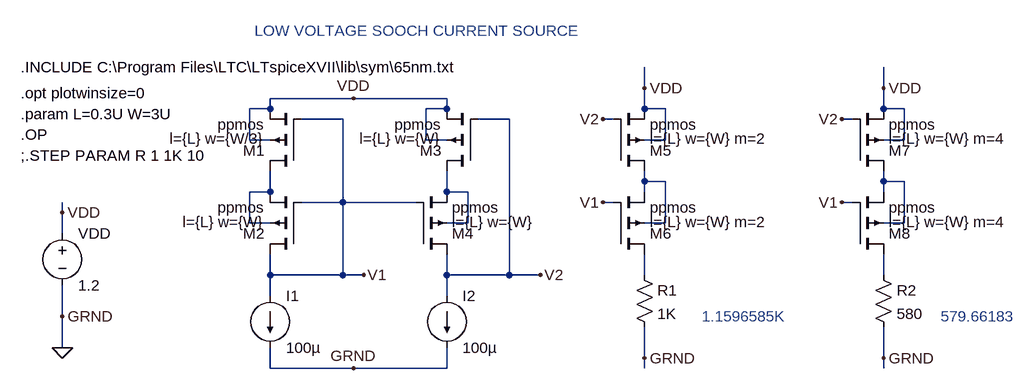
[diagram p0: schematic 16LOW VOLTAGE SOOCH CURRENT SOURCE.asc]
16LOW VOLTAGE SOOCH CURRENT SOURCE.asc, the LTspice schematic file:
Version 4
SHEET 1 1000 680
WIRE 432 -16 432 -48
WIRE 800 -16 800 -48
WIRE -16 0 -144 0
WIRE 128 0 -16 0
WIRE -144 16 -144 0
WIRE -144 16 -176 16
WIRE 128 16 128 0
WIRE 128 16 96 16
WIRE 432 16 432 -16
WIRE 464 16 432 16
WIRE 800 16 800 -16
WIRE 832 16 800 16
WIRE -32 32 -96 32
WIRE 224 32 176 32
WIRE 384 32 368 32
WIRE 752 32 736 32
WIRE -176 64 -176 16
WIRE -144 64 -176 64
WIRE 96 64 96 16
WIRE 128 64 96 64
WIRE 464 64 464 16
WIRE 464 64 432 64
WIRE 832 64 832 16
WIRE 832 64 800 64
WIRE 432 128 432 112
WIRE 464 128 432 128
WIRE 800 128 800 112
WIRE 832 128 800 128
WIRE -144 144 -144 112
WIRE -144 144 -176 144
WIRE 128 144 128 112
WIRE 160 144 128 144
WIRE 432 144 432 128
WIRE 800 144 800 128
WIRE -32 160 -32 32
WIRE -32 160 -96 160
WIRE 80 160 -32 160
WIRE 384 160 368 160
WIRE 752 160 736 160
WIRE -464 176 -464 160
WIRE -176 192 -176 144
WIRE -144 192 -176 192
WIRE 160 192 160 144
WIRE 160 192 128 192
WIRE 464 192 464 128
WIRE 464 192 432 192
WIRE 832 192 832 128
WIRE 832 192 800 192
WIRE -464 208 -464 176
WIRE -144 272 -144 240
WIRE -32 272 -32 160
WIRE -32 272 -144 272
WIRE 0 272 -32 272
WIRE 128 272 128 240
WIRE 224 272 224 32
WIRE 224 272 128 272
WIRE 272 272 224 272
WIRE 432 272 432 240
WIRE 800 272 800 240
WIRE -144 304 -144 272
WIRE 128 304 128 272
WIRE -464 336 -464 288
WIRE -464 384 -464 336
WIRE 432 400 432 352
WIRE 800 400 800 352
WIRE -144 416 -144 384
WIRE -16 416 -144 416
WIRE 128 416 128 384
WIRE 128 416 -16 416
WIRE 432 416 432 400
WIRE 800 416 800 400
FLAG -464 384 0
FLAG -464 336 GRND
FLAG -464 176 VDD
FLAG 0 272 V1
FLAG 368 160 V1
FLAG 272 272 V2
FLAG 368 32 V2
FLAG -16 416 GRND
FLAG 432 400 GRND
FLAG 432 -16 VDD
FLAG -16 0 VDD
FLAG 736 160 V1
FLAG 736 32 V2
FLAG 800 400 GRND
FLAG 800 -16 VDD
SYMBOL pmos4 -96 112 R180
WINDOW 123 56 50 Left 2
SYMATTR Value2 l={L} w={W/3}
SYMATTR InstName M1
SYMATTR Value ppmos
SYMBOL pmos4 -96 240 R180
WINDOW 123 56 50 Left 2
SYMATTR Value2 l={L} w={W}
SYMATTR InstName M2
SYMATTR Value ppmos
SYMBOL current -144 304 R0
WINDOW 123 0 0 Left 0
WINDOW 39 0 0 Left 0
SYMATTR InstName I1
SYMATTR Value 100µ
SYMBOL pmos4 80 240 M180
WINDOW 123 56 50 Left 2
SYMATTR Value2 l={L} w={W}
SYMATTR InstName M4
SYMATTR Value ppmos
SYMBOL pmos4 176 112 R180
WINDOW 123 56 50 Left 2
SYMATTR Value2 l={L} w={W}
SYMATTR InstName M3
SYMATTR Value ppmos
SYMBOL current 128 304 R0
WINDOW 123 0 0 Left 0
WINDOW 39 0 0 Left 0
SYMATTR InstName I2
SYMATTR Value 100µ
SYMBOL pmos4 384 112 M180
WINDOW 123 56 50 Left 2
SYMATTR Value2 l={L} w={W} m=2
SYMATTR InstName M5
SYMATTR Value ppmos
SYMBOL pmos4 384 240 M180
WINDOW 123 56 50 Left 2
SYMATTR Value2 l={L} w={W} m=2
SYMATTR InstName M6
SYMATTR Value ppmos
SYMBOL voltage -464 192 R0
WINDOW 123 0 0 Left 0
WINDOW 39 0 0 Left 0
SYMATTR InstName VDD
SYMATTR Value 1.2
SYMBOL res 416 256 R0
SYMATTR InstName R1
SYMATTR Value 1K
SYMBOL pmos4 752 112 M180
WINDOW 123 56 50 Left 2
SYMATTR Value2 l={L} w={W} m=4
SYMATTR InstName M7
SYMATTR Value ppmos
SYMBOL pmos4 752 240 M180
WINDOW 123 56 50 Left 2
SYMATTR Value2 l={L} w={W} m=4
SYMATTR InstName M8
SYMATTR Value ppmos
SYMBOL res 784 256 R0
SYMATTR InstName R2
SYMATTR Value 580
TEXT -528 -48 Left 2 !.INCLUDE C:\\Program Files\\LTC\\LTspiceXVII\\lib\\sym\\65nm.txt
TEXT -528 -8 Left 2 !.opt plotwinsize=0
TEXT -528 56 Left 2 !.OP
TEXT -528 24 Left 2 !.param L=0.3U W=3U
TEXT -168 -104 Left 2 ;LOW VOLTAGE SOOCH CURRENT SOURCE
TEXT -528 88 Left 2 !;.STEP PARAM R 1 1K 10
TEXT 520 336 Left 2 ;1.1596585K
TEXT 888 336 Left 2 ;579.66183

The netlist it stands for:
* 16LOW VOLTAGE SOOCH CURRENT SOURCE.asc
M1 N003 V1 VDD VDD ppmos l={L} w={W/3}
M2 V1 V1 N003 N003 ppmos l={L} w={W}
I1 V1 0 100µ
M4 V2 V1 N004 N004 ppmos l={L} w={W}
M3 N004 V2 VDD VDD ppmos l={L} w={W}
I2 V2 0 100µ
M5 N001 V2 VDD VDD ppmos l={L} w={W} m=2
M6 N005 V1 N001 N001 ppmos l={L} w={W} m=2
VDD VDD 0 1.2
R1 N005 0 1K
M7 N002 V2 VDD VDD ppmos l={L} w={W} m=4
M8 N006 V1 N002 N002 ppmos l={L} w={W} m=4
R2 N006 0 580
.model NMOS NMOS
.model PMOS PMOS
.lib standard.mos
.INCLUDE C:\Program Files\LTC\LTspiceXVII\lib\sym\65nm.txt
.opt plotwinsize=0
.OP
.param L=0.3U W=3U
* LOW VOLTAGE SOOCH CURRENT SOURCE
;.STEP PARAM R 1 1K 10
* 1.1596585K
* 579.66183
.backanno
.end